# Altium project TK511_Blindkort.PrjPcb
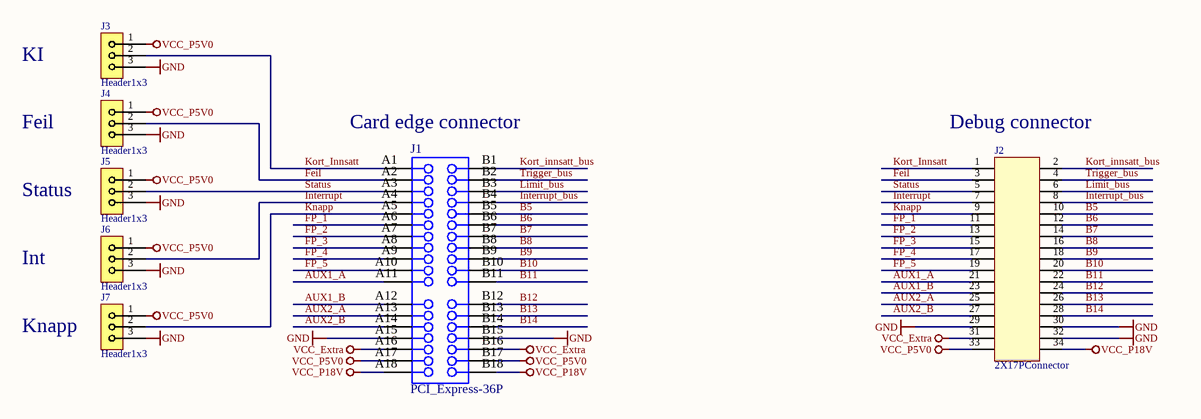
[diagram p0: TK511_Blindkort.SchDoc]
Revision: 1.1
1 sheet, 7 parts. Net scope: global (net labels, ports and power ports of the same name join across sheets).
Board file: TK511_Blindkort.PcbDoc

## Sheet TK511_Blindkort.SchDoc: TK511 Blindkort
size A3; Author: Øystein Smith; Organization: Omega Verksted; DocumentNumber: 5; Revision: 1.1; SheetNumber: 5; SheetTotal: 20

### Parts
J1  PCI_Express-36P  [PCIeX1-GF-2D-1000-1K-O36]
J2  2X17PConnector  [HDRV34W64P254_2X17_5070X900X900B]
J3  Header1x3  [HDRV3W64P254_1X3_762X254X900B]
J4  Header1x3  [HDRV3W64P254_1X3_762X254X900B]
J5  Header1x3  [HDRV3W64P254_1X3_762X254X900B]
J6  Header1x3  [HDRV3W64P254_1X3_762X254X900B]
J7  Header1x3  [HDRV3W64P254_1X3_762X254X900B]

### Nets
GND: J1.A15 J1.B15 J2.29 J2.30 J2.32 J3.3 J4.3 J5.3 J6.3 J7.3
VCC_Extra: J1.A16 J1.B16 J2.31
VCC_P5V0: J1.A17 J1.B17 J2.33 J3.1 J4.1 J5.1 J6.1 J7.1
VCC_P18V: J1.A18 J1.B18 J2.34
AUX1_A: J1.A11 J2.21
AUX1_B: J1.A12 J2.23
AUX2_A: J1.A13 J2.25
AUX2_B: J1.A14 J2.27
B5: J1.B5 J2.10
B6: J1.B6 J2.12
B7: J1.B7 J2.14
B8: J1.B8 J2.16
B9: J1.B9 J2.18
B10: J1.B10 J2.20
B11: J1.B11 J2.22
B12: J1.B12 J2.24
B13: J1.B13 J2.26
B14: J1.B14 J2.28
Feil: J1.A2 J2.3 J4.2
FP_1: J1.A6 J2.11
FP_2: J1.A7 J2.13
FP_3: J1.A8 J2.15
FP_4: J1.A9 J2.17
FP_5: J1.A10 J2.19
Interrupt: J1.A4 J2.7 J6.2
Interrupt_bus: J1.B4 J2.8
Knapp: J1.A5 J2.9 J7.2
Kort_Innsatt: J1.A1 J2.1 J3.2
Kort_innsatt_bus: J1.B1 J2.2
Limit_bus: J1.B3 J2.6
Status: J1.A3 J2.5 J5.2
Trigger_bus: J1.B2 J2.4

### Notes on the sheet
- KI
- Feil
- (near J1) Card edge connector
- (near J2) Debug connector
- (near J5) Status
- Int
- Knapp
- Size:
- Date:
- Title:
- A3
- Revision:
- Sheet
- of
- Author:
- File:

### Library data of the parts
J1 = 3037: PCI express PCB kortkankonnektor; pakke_opprettet_av: 815; pris: 0; id: 3037; komponenttype: 11; produsent: PCB feature; navn: PCIeX1-GF-2D-1000-1K-O36; pakke_opprettet: 07/06/2015 17:49:10; symbol_opprettet_av: 815; symbol_opprettet: 06/07/2014 17:26:37; pakketype: -
J2 = 3259: Header; id: 3259; pakke_opprettet_av: 815; navn: Header 2X17 Shrouded; pris: 10; nokkelord: IDE; pakketype: TH; leverandor_varenr: 2215313; produsent: Amphenol; leverandor: Farnell; komponenttype: 11; pakke_opprettet: 12/07/2014 17:05:20; symbol_opprettet_av: 815; symbol_opprettet: 12/07/2014 17:03:56
J3-J7 = 5095: 2,54mm pitch; id: 5095; pakke_opprettet_av: 815; pris: 2; pakketype: TH; komponenttype: 11; leverandor: Farnell; leverandor_varenr: 3690124; produsent: SAMTEC; pakke_opprettet: 13/11/2014 12:31:03; symbol_opprettet_av: 815; symbol_opprettet: 13/11/2014 10:59:05; navn: Header 1x3